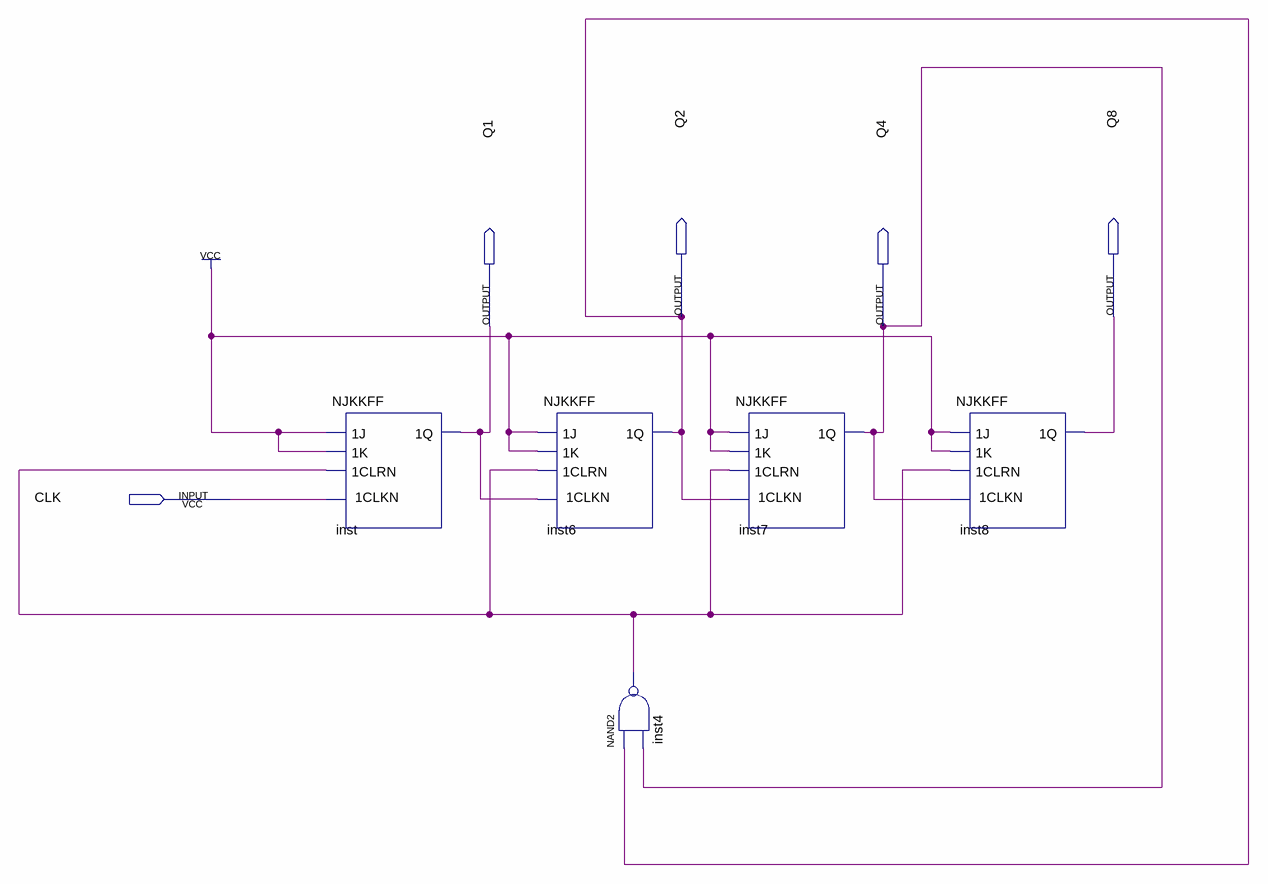
[diagram p0: schematic sheet]
// Quartus schematic mod6.bdf as structural Verilog: 5 symbols, 5 pins
module mod6 (
  input  CLK,
  output Q2,
  output Q8,
  output Q1,
  output Q4
);

  wire inst4_out;

  NJKKFF inst (.\1J (1'b1), .\1K (1'b1), .\1CLKN (CLK), .\1CLRN (inst4_out), .\1Q (Q1));
  NJKKFF inst6 (.\1J (1'b1), .\1K (1'b1), .\1CLKN (Q1), .\1CLRN (inst4_out), .\1Q (Q2));
  nand inst4 (inst4_out, Q2, Q4);
  NJKKFF inst7 (.\1J (1'b1), .\1K (1'b1), .\1CLKN (Q2), .\1CLRN (inst4_out), .\1Q (Q4));
  NJKKFF inst8 (.\1J (1'b1), .\1K (1'b1), .\1CLKN (Q4), .\1CLRN (inst4_out), .\1Q (Q8));
endmodule
